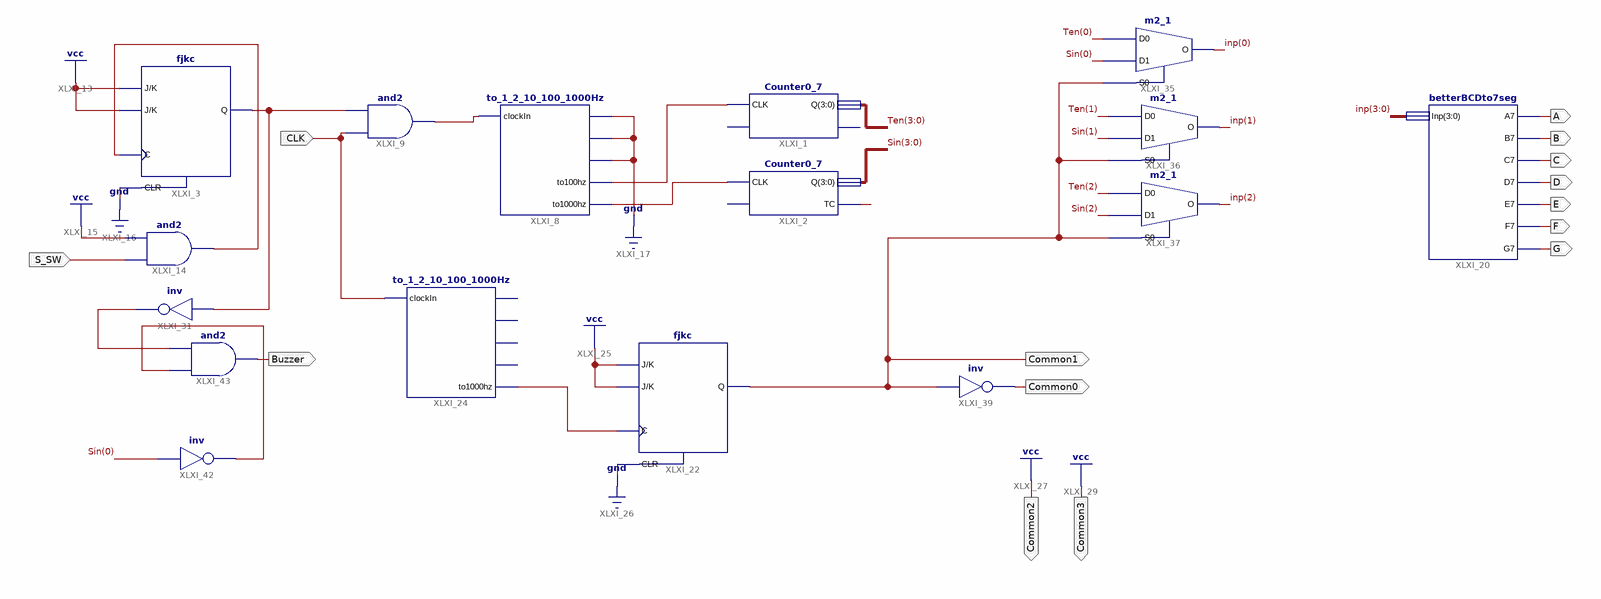
[diagram p0: schematic sheet 1]
// Xilinx ISE schematic main.sch (spartan6) as structural Verilog: 16 symbols, 14 ports
module main (
  input  CLK,
  input  S_SW,
  output Common1,
  output Common2,
  output Common3,
  output Buzzer,
  output A,
  output B,
  output C,
  output D,
  output E,
  output F,
  output G,
  output Common0
);

  wire beep, XLXN_1, XLXN_2, XLXN_6, XLXN_7, XLXN_16, XLXN_35, XLXN_71, XLXN_108;
  wire [3:0] inp, Sin, Ten;

  fjkc XLXI_3 (.C(XLXN_16), .CLR(1'b0), .J(1'b1), .K(1'b1), .Q(XLXN_6));
  and XLXI_9 (XLXN_7, CLK, XLXN_6);
  Counter0_7 XLXI_1 (.CLK(XLXN_1), .Q(Ten));  // open: Reset, TC
  Counter0_7 XLXI_2 (.CLK(XLXN_2), .Q(Sin), .TC(beep));  // open: Reset
  to_1_2_10_100_1000Hz XLXI_8 (
    .clockIn(XLXN_7), .to1hz(1'b0), .to2hz(1'b0), .to10hz(1'b0), .to100hz(XLXN_1), .to1000hz(XLXN_2));
  and XLXI_14 (XLXN_16, S_SW, 1'b1);
  fjkc XLXI_22 (.C(XLXN_35), .CLR(1'b0), .J(1'b1), .K(1'b1), .Q(Common1));
  to_1_2_10_100_1000Hz XLXI_24 (.clockIn(CLK), .to1000hz(XLXN_35));  // open: to1hz, to2hz, to10hz, to100hz
  m2_1 XLXI_35 (.D0(Ten[0]), .D1(Sin[0]), .S0(Common1), .O(inp[0]));
  m2_1 XLXI_36 (.D0(Ten[1]), .D1(Sin[1]), .S0(Common1), .O(inp[1]));
  m2_1 XLXI_37 (.D0(Ten[2]), .D1(Sin[2]), .S0(Common1), .O(inp[2]));
  betterBCDto7seg XLXI_20 (.Inp(inp), .A7(A), .B7(B), .C7(C), .D7(D), .E7(E), .F7(F), .G7(G));
  not XLXI_39 (Common0, Common1);
  not XLXI_31 (XLXN_71, XLXN_6);
  not XLXI_42 (XLXN_108, Sin[0]);
  and XLXI_43 (Buzzer, XLXN_108, XLXN_71);

  assign Common2 = 1'b1;
  assign Common3 = 1'b1;
endmodule
